# EAGLE schematic fig4-9 (EAGLE 6.6.0)

## Sheet 1 of 2
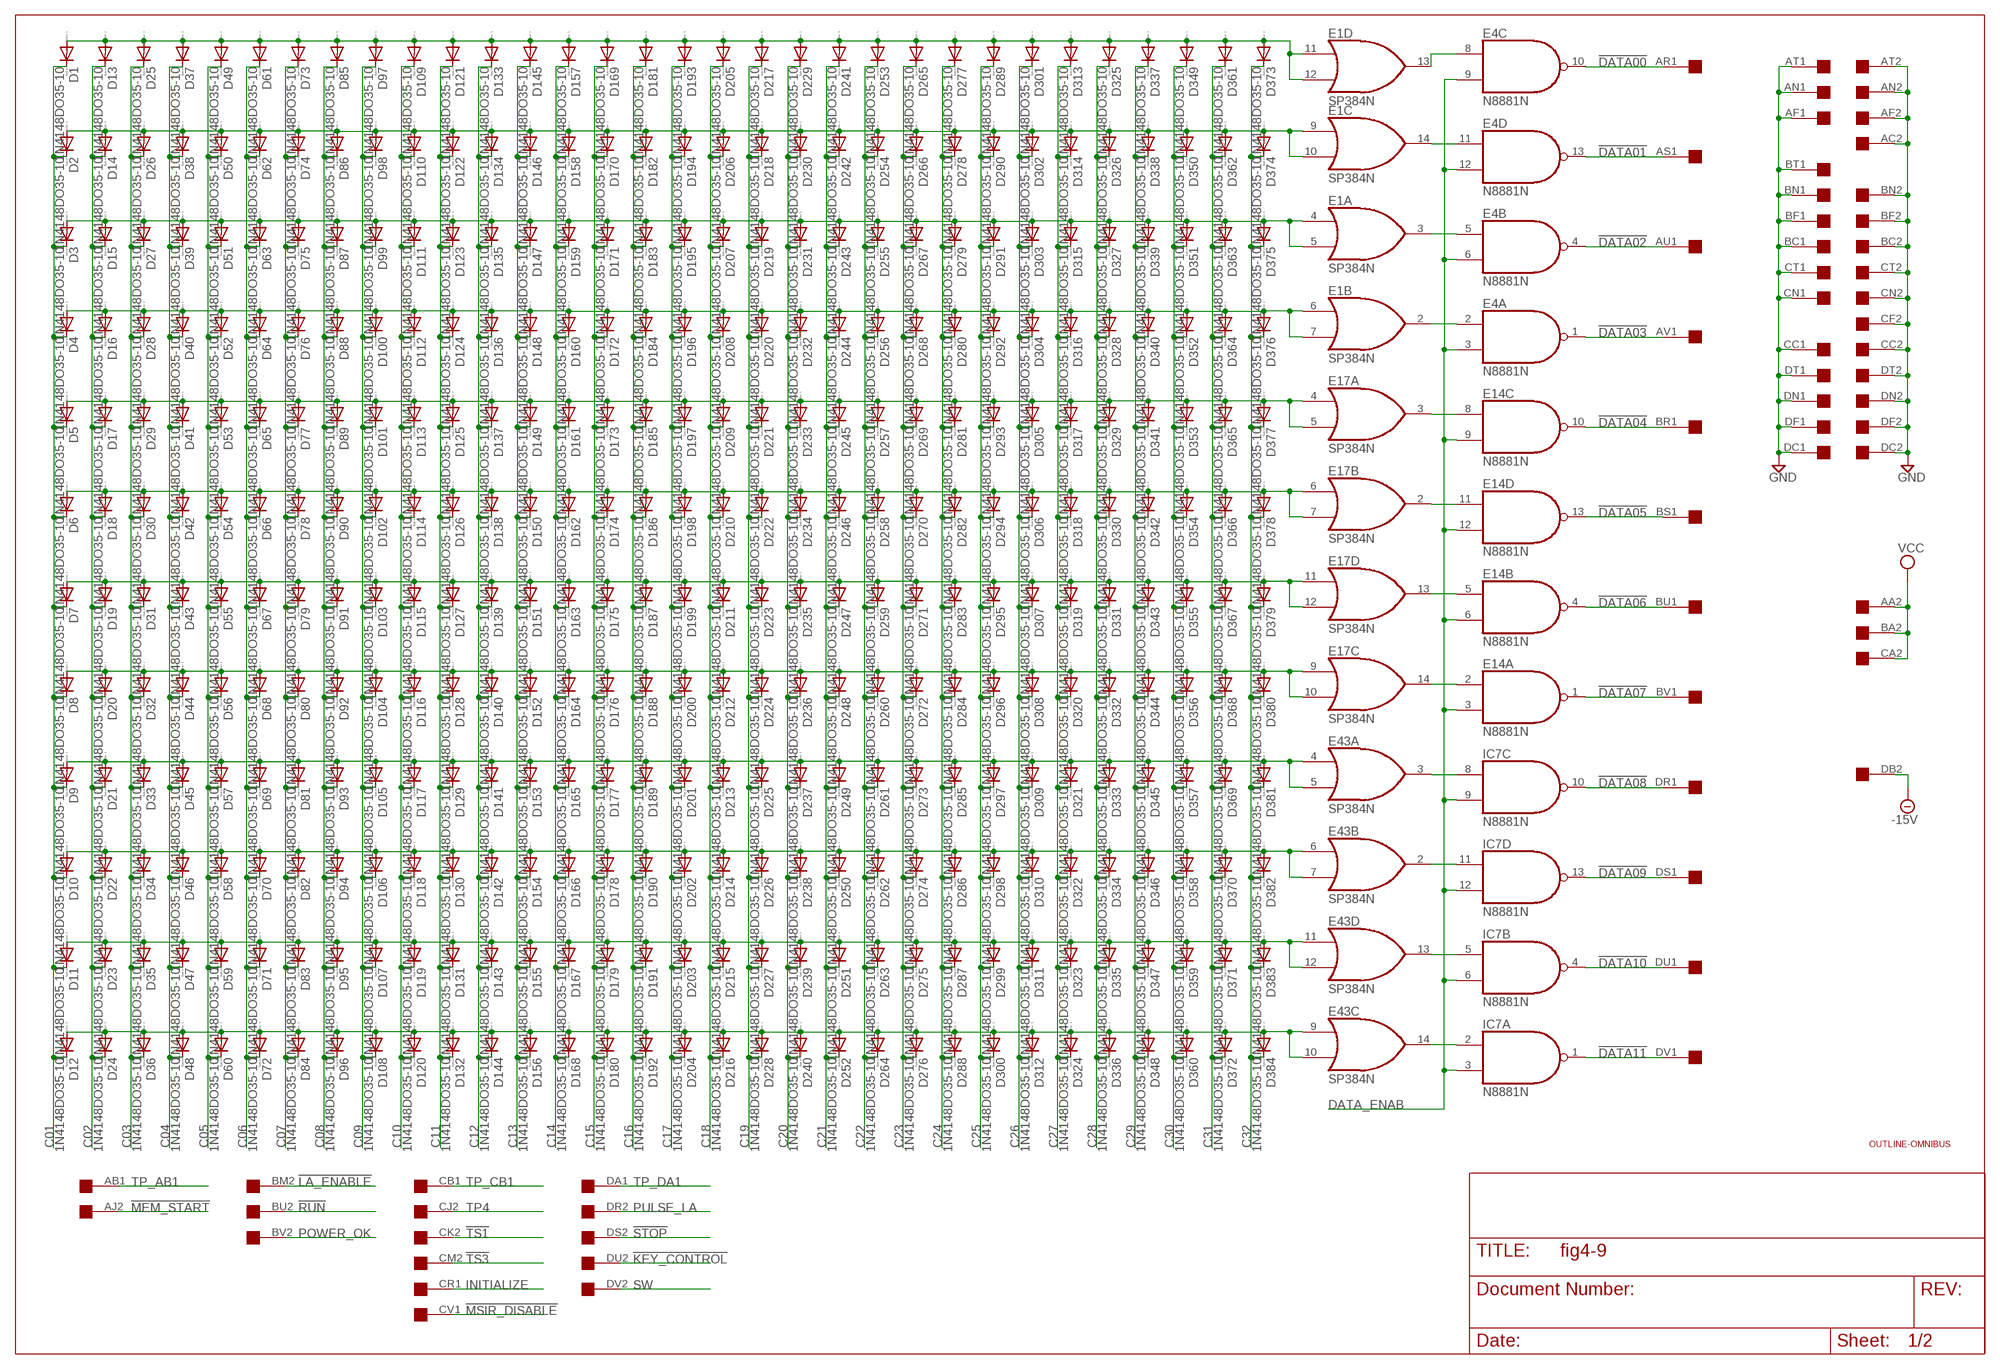
[diagram p0: schematic, sheet 1]

### Parts
D1  1N4148DO35-10  [DO35-10]
D2  1N4148DO35-10  [DO35-10]
D3  1N4148DO35-10  [DO35-10]
D4  1N4148DO35-10  [DO35-10]
D5  1N4148DO35-10  [DO35-10]
D6  1N4148DO35-10  [DO35-10]
D7  1N4148DO35-10  [DO35-10]
D8  1N4148DO35-10  [DO35-10]
D9  1N4148DO35-10  [DO35-10]
D10  1N4148DO35-10  [DO35-10]
D11  1N4148DO35-10  [DO35-10]
D12  1N4148DO35-10  [DO35-10]
D13  1N4148DO35-10  [DO35-10]
D14  1N4148DO35-10  [DO35-10]
D15  1N4148DO35-10  [DO35-10]
D16  1N4148DO35-10  [DO35-10]
D17  1N4148DO35-10  [DO35-10]
D18  1N4148DO35-10  [DO35-10]
D19  1N4148DO35-10  [DO35-10]
D20  1N4148DO35-10  [DO35-10]
D21  1N4148DO35-10  [DO35-10]
D22  1N4148DO35-10  [DO35-10]
D23  1N4148DO35-10  [DO35-10]
D24  1N4148DO35-10  [DO35-10]
D25  1N4148DO35-10  [DO35-10]
D26  1N4148DO35-10  [DO35-10]
D27  1N4148DO35-10  [DO35-10]
D28  1N4148DO35-10  [DO35-10]
D29  1N4148DO35-10  [DO35-10]
D30  1N4148DO35-10  [DO35-10]
D31  1N4148DO35-10  [DO35-10]
D32  1N4148DO35-10  [DO35-10]
D33  1N4148DO35-10  [DO35-10]
D34  1N4148DO35-10  [DO35-10]
D35  1N4148DO35-10  [DO35-10]
D36  1N4148DO35-10  [DO35-10]
D37  1N4148DO35-10  [DO35-10]
D38  1N4148DO35-10  [DO35-10]
D39  1N4148DO35-10  [DO35-10]
D40  1N4148DO35-10  [DO35-10]
D41  1N4148DO35-10  [DO35-10]
D42  1N4148DO35-10  [DO35-10]
D43  1N4148DO35-10  [DO35-10]
D44  1N4148DO35-10  [DO35-10]
D45  1N4148DO35-10  [DO35-10]
D46  1N4148DO35-10  [DO35-10]
D47  1N4148DO35-10  [DO35-10]
D48  1N4148DO35-10  [DO35-10]
D49  1N4148DO35-10  [DO35-10]
D50  1N4148DO35-10  [DO35-10]
D51  1N4148DO35-10  [DO35-10]
D52  1N4148DO35-10  [DO35-10]
D53  1N4148DO35-10  [DO35-10]
D54  1N4148DO35-10  [DO35-10]
D55  1N4148DO35-10  [DO35-10]
D56  1N4148DO35-10  [DO35-10]
D57  1N4148DO35-10  [DO35-10]
D58  1N4148DO35-10  [DO35-10]
D59  1N4148DO35-10  [DO35-10]
D60  1N4148DO35-10  [DO35-10]
D61  1N4148DO35-10  [DO35-10]
D62  1N4148DO35-10  [DO35-10]
D63  1N4148DO35-10  [DO35-10]
D64  1N4148DO35-10  [DO35-10]
D65  1N4148DO35-10  [DO35-10]
D66  1N4148DO35-10  [DO35-10]
D67  1N4148DO35-10  [DO35-10]
D68  1N4148DO35-10  [DO35-10]
D69  1N4148DO35-10  [DO35-10]
D70  1N4148DO35-10  [DO35-10]
D71  1N4148DO35-10  [DO35-10]
D72  1N4148DO35-10  [DO35-10]
D73  1N4148DO35-10  [DO35-10]
D74  1N4148DO35-10  [DO35-10]
D75  1N4148DO35-10  [DO35-10]
D76  1N4148DO35-10  [DO35-10]
D77  1N4148DO35-10  [DO35-10]
D78  1N4148DO35-10  [DO35-10]
D79  1N4148DO35-10  [DO35-10]
D80  1N4148DO35-10  [DO35-10]
D81  1N4148DO35-10  [DO35-10]
D82  1N4148DO35-10  [DO35-10]
D83  1N4148DO35-10  [DO35-10]
D84  1N4148DO35-10  [DO35-10]
D85  1N4148DO35-10  [DO35-10]
D86  1N4148DO35-10  [DO35-10]
D87  1N4148DO35-10  [DO35-10]
D88  1N4148DO35-10  [DO35-10]
D89  1N4148DO35-10  [DO35-10]
D90  1N4148DO35-10  [DO35-10]
D91  1N4148DO35-10  [DO35-10]
D92  1N4148DO35-10  [DO35-10]
D93  1N4148DO35-10  [DO35-10]
D94  1N4148DO35-10  [DO35-10]
D95  1N4148DO35-10  [DO35-10]
D96  1N4148DO35-10  [DO35-10]
D97  1N4148DO35-10  [DO35-10]
D98  1N4148DO35-10  [DO35-10]
D99  1N4148DO35-10  [DO35-10]
D100  1N4148DO35-10  [DO35-10]
D101  1N4148DO35-10  [DO35-10]
D102  1N4148DO35-10  [DO35-10]
D103  1N4148DO35-10  [DO35-10]
D104  1N4148DO35-10  [DO35-10]
D105  1N4148DO35-10  [DO35-10]
D106  1N4148DO35-10  [DO35-10]
D107  1N4148DO35-10  [DO35-10]
D108  1N4148DO35-10  [DO35-10]
D109  1N4148DO35-10  [DO35-10]
D110  1N4148DO35-10  [DO35-10]
D111  1N4148DO35-10  [DO35-10]
D112  1N4148DO35-10  [DO35-10]
D113  1N4148DO35-10  [DO35-10]
D114  1N4148DO35-10  [DO35-10]
D115  1N4148DO35-10  [DO35-10]
D116  1N4148DO35-10  [DO35-10]
D117  1N4148DO35-10  [DO35-10]
D118  1N4148DO35-10  [DO35-10]
D119  1N4148DO35-10  [DO35-10]
D120  1N4148DO35-10  [DO35-10]
D121  1N4148DO35-10  [DO35-10]
D122  1N4148DO35-10  [DO35-10]
D123  1N4148DO35-10  [DO35-10]
D124  1N4148DO35-10  [DO35-10]
D125  1N4148DO35-10  [DO35-10]
D126  1N4148DO35-10  [DO35-10]
D127  1N4148DO35-10  [DO35-10]
D128  1N4148DO35-10  [DO35-10]
D129  1N4148DO35-10  [DO35-10]
D130  1N4148DO35-10  [DO35-10]
D131  1N4148DO35-10  [DO35-10]
D132  1N4148DO35-10  [DO35-10]
D133  1N4148DO35-10  [DO35-10]
D134  1N4148DO35-10  [DO35-10]
D135  1N4148DO35-10  [DO35-10]
D136  1N4148DO35-10  [DO35-10]
D137  1N4148DO35-10  [DO35-10]
D138  1N4148DO35-10  [DO35-10]
D139  1N4148DO35-10  [DO35-10]
D140  1N4148DO35-10  [DO35-10]
D141  1N4148DO35-10  [DO35-10]
D142  1N4148DO35-10  [DO35-10]
D143  1N4148DO35-10  [DO35-10]
D144  1N4148DO35-10  [DO35-10]
D145  1N4148DO35-10  [DO35-10]
D146  1N4148DO35-10  [DO35-10]
D147  1N4148DO35-10  [DO35-10]
D148  1N4148DO35-10  [DO35-10]
D149  1N4148DO35-10  [DO35-10]
D150  1N4148DO35-10  [DO35-10]
D151  1N4148DO35-10  [DO35-10]
D152  1N4148DO35-10  [DO35-10]
D153  1N4148DO35-10  [DO35-10]
D154  1N4148DO35-10  [DO35-10]
D155  1N4148DO35-10  [DO35-10]
D156  1N4148DO35-10  [DO35-10]
D157  1N4148DO35-10  [DO35-10]
D158  1N4148DO35-10  [DO35-10]
D159  1N4148DO35-10  [DO35-10]
D160  1N4148DO35-10  [DO35-10]
D161  1N4148DO35-10  [DO35-10]
D162  1N4148DO35-10  [DO35-10]
D163  1N4148DO35-10  [DO35-10]
D164  1N4148DO35-10  [DO35-10]
D165  1N4148DO35-10  [DO35-10]
D166  1N4148DO35-10  [DO35-10]
D167  1N4148DO35-10  [DO35-10]
D168  1N4148DO35-10  [DO35-10]
D169  1N4148DO35-10  [DO35-10]
D170  1N4148DO35-10  [DO35-10]
D171  1N4148DO35-10  [DO35-10]
D172  1N4148DO35-10  [DO35-10]
D173  1N4148DO35-10  [DO35-10]
D174  1N4148DO35-10  [DO35-10]
D175  1N4148DO35-10  [DO35-10]
D176  1N4148DO35-10  [DO35-10]
D177  1N4148DO35-10  [DO35-10]
D178  1N4148DO35-10  [DO35-10]
D179  1N4148DO35-10  [DO35-10]
D180  1N4148DO35-10  [DO35-10]
D181  1N4148DO35-10  [DO35-10]
D182  1N4148DO35-10  [DO35-10]
D183  1N4148DO35-10  [DO35-10]
D184  1N4148DO35-10  [DO35-10]
D185  1N4148DO35-10  [DO35-10]
D186  1N4148DO35-10  [DO35-10]
D187  1N4148DO35-10  [DO35-10]
D188  1N4148DO35-10  [DO35-10]
D189  1N4148DO35-10  [DO35-10]
D190  1N4148DO35-10  [DO35-10]
D191  1N4148DO35-10  [DO35-10]
D192  1N4148DO35-10  [DO35-10]
D193  1N4148DO35-10  [DO35-10]
D194  1N4148DO35-10  [DO35-10]
D195  1N4148DO35-10  [DO35-10]
D196  1N4148DO35-10  [DO35-10]
D197  1N4148DO35-10  [DO35-10]
D198  1N4148DO35-10  [DO35-10]
D199  1N4148DO35-10  [DO35-10]
D200  1N4148DO35-10  [DO35-10]
D201  1N4148DO35-10  [DO35-10]
D202  1N4148DO35-10  [DO35-10]
D203  1N4148DO35-10  [DO35-10]
D204  1N4148DO35-10  [DO35-10]
D205  1N4148DO35-10  [DO35-10]
D206  1N4148DO35-10  [DO35-10]
D207  1N4148DO35-10  [DO35-10]
D208  1N4148DO35-10  [DO35-10]
D209  1N4148DO35-10  [DO35-10]
D210  1N4148DO35-10  [DO35-10]
D211  1N4148DO35-10  [DO35-10]
D212  1N4148DO35-10  [DO35-10]
D213  1N4148DO35-10  [DO35-10]
D214  1N4148DO35-10  [DO35-10]
D215  1N4148DO35-10  [DO35-10]
D216  1N4148DO35-10  [DO35-10]
D217  1N4148DO35-10  [DO35-10]
D218  1N4148DO35-10  [DO35-10]
D219  1N4148DO35-10  [DO35-10]
D220  1N4148DO35-10  [DO35-10]
D221  1N4148DO35-10  [DO35-10]
D222  1N4148DO35-10  [DO35-10]
D223  1N4148DO35-10  [DO35-10]
D224  1N4148DO35-10  [DO35-10]
D225  1N4148DO35-10  [DO35-10]
D226  1N4148DO35-10  [DO35-10]
D227  1N4148DO35-10  [DO35-10]
D228  1N4148DO35-10  [DO35-10]
D229  1N4148DO35-10  [DO35-10]
D230  1N4148DO35-10  [DO35-10]
D231  1N4148DO35-10  [DO35-10]
D232  1N4148DO35-10  [DO35-10]
D233  1N4148DO35-10  [DO35-10]
D234  1N4148DO35-10  [DO35-10]
D235  1N4148DO35-10  [DO35-10]
D236  1N4148DO35-10  [DO35-10]
D237  1N4148DO35-10  [DO35-10]
D238  1N4148DO35-10  [DO35-10]
D239  1N4148DO35-10  [DO35-10]
D240  1N4148DO35-10  [DO35-10]
D241  1N4148DO35-10  [DO35-10]
D242  1N4148DO35-10  [DO35-10]
D243  1N4148DO35-10  [DO35-10]
D244  1N4148DO35-10  [DO35-10]
D245  1N4148DO35-10  [DO35-10]
D246  1N4148DO35-10  [DO35-10]
D247  1N4148DO35-10  [DO35-10]
D248  1N4148DO35-10  [DO35-10]
D249  1N4148DO35-10  [DO35-10]
D250  1N4148DO35-10  [DO35-10]
D251  1N4148DO35-10  [DO35-10]
D252  1N4148DO35-10  [DO35-10]
D253  1N4148DO35-10  [DO35-10]
D254  1N4148DO35-10  [DO35-10]
D255  1N4148DO35-10  [DO35-10]
D256  1N4148DO35-10  [DO35-10]
D257  1N4148DO35-10  [DO35-10]
D258  1N4148DO35-10  [DO35-10]
D259  1N4148DO35-10  [DO35-10]
D260  1N4148DO35-10  [DO35-10]
D261  1N4148DO35-10  [DO35-10]
D262  1N4148DO35-10  [DO35-10]
D263  1N4148DO35-10  [DO35-10]
D264  1N4148DO35-10  [DO35-10]
D265  1N4148DO35-10  [DO35-10]
D266  1N4148DO35-10  [DO35-10]
D267  1N4148DO35-10  [DO35-10]
D268  1N4148DO35-10  [DO35-10]
D269  1N4148DO35-10  [DO35-10]
D270  1N4148DO35-10  [DO35-10]
D271  1N4148DO35-10  [DO35-10]
D272  1N4148DO35-10  [DO35-10]
D273  1N4148DO35-10  [DO35-10]
D274  1N4148DO35-10  [DO35-10]
D275  1N4148DO35-10  [DO35-10]
D276  1N4148DO35-10  [DO35-10]
D277  1N4148DO35-10  [DO35-10]
D278  1N4148DO35-10  [DO35-10]
D279  1N4148DO35-10  [DO35-10]
D280  1N4148DO35-10  [DO35-10]
D281  1N4148DO35-10  [DO35-10]
D282  1N4148DO35-10  [DO35-10]
D283  1N4148DO35-10  [DO35-10]
D284  1N4148DO35-10  [DO35-10]
D285  1N4148DO35-10  [DO35-10]
D286  1N4148DO35-10  [DO35-10]
D287  1N4148DO35-10  [DO35-10]
D288  1N4148DO35-10  [DO35-10]
D289  1N4148DO35-10  [DO35-10]
D290  1N4148DO35-10  [DO35-10]
D291  1N4148DO35-10  [DO35-10]
D292  1N4148DO35-10  [DO35-10]
D293  1N4148DO35-10  [DO35-10]
D294  1N4148DO35-10  [DO35-10]
D295  1N4148DO35-10  [DO35-10]
D296  1N4148DO35-10  [DO35-10]
D297  1N4148DO35-10  [DO35-10]
D298  1N4148DO35-10  [DO35-10]
D299  1N4148DO35-10  [DO35-10]
D300  1N4148DO35-10  [DO35-10]
D301  1N4148DO35-10  [DO35-10]
D302  1N4148DO35-10  [DO35-10]
D303  1N4148DO35-10  [DO35-10]
D304  1N4148DO35-10  [DO35-10]
D305  1N4148DO35-10  [DO35-10]
D306  1N4148DO35-10  [DO35-10]
D307  1N4148DO35-10  [DO35-10]
D308  1N4148DO35-10  [DO35-10]
D309  1N4148DO35-10  [DO35-10]
D310  1N4148DO35-10  [DO35-10]
D311  1N4148DO35-10  [DO35-10]
D312  1N4148DO35-10  [DO35-10]
D313  1N4148DO35-10  [DO35-10]
D314  1N4148DO35-10  [DO35-10]
D315  1N4148DO35-10  [DO35-10]
D316  1N4148DO35-10  [DO35-10]
D317  1N4148DO35-10  [DO35-10]
D318  1N4148DO35-10  [DO35-10]
D319  1N4148DO35-10  [DO35-10]
D320  1N4148DO35-10  [DO35-10]
D321  1N4148DO35-10  [DO35-10]
D322  1N4148DO35-10  [DO35-10]
D323  1N4148DO35-10  [DO35-10]
D324  1N4148DO35-10  [DO35-10]
D325  1N4148DO35-10  [DO35-10]
D326  1N4148DO35-10  [DO35-10]
D327  1N4148DO35-10  [DO35-10]
D328  1N4148DO35-10  [DO35-10]
D329  1N4148DO35-10  [DO35-10]
D330  1N4148DO35-10  [DO35-10]
D331  1N4148DO35-10  [DO35-10]
D332  1N4148DO35-10  [DO35-10]
D333  1N4148DO35-10  [DO35-10]
D334  1N4148DO35-10  [DO35-10]
D335  1N4148DO35-10  [DO35-10]
D336  1N4148DO35-10  [DO35-10]
D337  1N4148DO35-10  [DO35-10]
D338  1N4148DO35-10  [DO35-10]
D339  1N4148DO35-10  [DO35-10]
D340  1N4148DO35-10  [DO35-10]
D341  1N4148DO35-10  [DO35-10]
D342  1N4148DO35-10  [DO35-10]
D343  1N4148DO35-10  [DO35-10]
D344  1N4148DO35-10  [DO35-10]
D345  1N4148DO35-10  [DO35-10]
D346  1N4148DO35-10  [DO35-10]
D347  1N4148DO35-10  [DO35-10]
D348  1N4148DO35-10  [DO35-10]
D349  1N4148DO35-10  [DO35-10]
D350  1N4148DO35-10  [DO35-10]
D351  1N4148DO35-10  [DO35-10]
D352  1N4148DO35-10  [DO35-10]
D353  1N4148DO35-10  [DO35-10]
D354  1N4148DO35-10  [DO35-10]
D355  1N4148DO35-10  [DO35-10]
D356  1N4148DO35-10  [DO35-10]
D357  1N4148DO35-10  [DO35-10]
D358  1N4148DO35-10  [DO35-10]
D359  1N4148DO35-10  [DO35-10]
D360  1N4148DO35-10  [DO35-10]
D361  1N4148DO35-10  [DO35-10]
D362  1N4148DO35-10  [DO35-10]
D363  1N4148DO35-10  [DO35-10]
D364  1N4148DO35-10  [DO35-10]
D365  1N4148DO35-10  [DO35-10]
D366  1N4148DO35-10  [DO35-10]
D367  1N4148DO35-10  [DO35-10]
D368  1N4148DO35-10  [DO35-10]
D369  1N4148DO35-10  [DO35-10]
D370  1N4148DO35-10  [DO35-10]
D371  1N4148DO35-10  [DO35-10]
D372  1N4148DO35-10  [DO35-10]
D373  1N4148DO35-10  [DO35-10]
D374  1N4148DO35-10  [DO35-10]
D375  1N4148DO35-10  [DO35-10]
D376  1N4148DO35-10  [DO35-10]
D377  1N4148DO35-10  [DO35-10]
D378  1N4148DO35-10  [DO35-10]
D379  1N4148DO35-10  [DO35-10]
D380  1N4148DO35-10  [DO35-10]
D381  1N4148DO35-10  [DO35-10]
D382  1N4148DO35-10  [DO35-10]
D383  1N4148DO35-10  [DO35-10]
D384  1N4148DO35-10  [DO35-10]
E1  SP384N  [DIL14]
E4  N8881N  [DIL14]
E14  N8881N  [DIL14]
E17  SP384N  [DIL14]
E43  SP384N  [DIL14]
IC7  N8881N  [DIL14]
U$1  OUTLINE-OMNIBUS  [OMNIBUS]
U$2  QUAD  [EDGE-CON8]

### Nets
!DATA00: E4.10(C:O) U$2.AR1
!DATA01: E4.13(D:O) U$2.AS1
!DATA02: E4.4(B:O) U$2.AU1
!DATA03: E4.1(A:O) U$2.AV1
!DATA04: E14.10(C:O) U$2.BR1
!DATA05: E14.13(D:O) U$2.BS1
!DATA06: E14.4(B:O) U$2.BU1
!DATA07: E14.1(A:O) U$2.BV1
!DATA08: IC7.10(C:O) U$2.DR1
!DATA09: IC7.13(D:O) U$2.DS1
!DATA10: IC7.4(B:O) U$2.DU1
!DATA11: IC7.1(A:O) U$2.DV1
!KEY_CONTROL: U$2.DU2
!LA_ENABLE: U$2.BM2
!MEM_START: U$2.AJ2
!MSIR_DISABLE: U$2.CV1
!RUN: U$2.BU2
!STOP: U$2.DS2
!TS1: U$2.CK2 ; also sheet 2
!TS3: U$2.CM2
-15V: U$2.DB2
C01: D1.C D2.C D3.C D4.C D5.C D6.C D7.C D8.C D9.C D10.C D11.C D12.C ; also sheet 2
C02: D13.C D14.C D15.C D16.C D17.C D18.C D19.C D20.C D21.C D22.C D23.C D24.C ; also sheet 2
C03: D25.C D26.C D27.C D28.C D29.C D30.C D31.C D32.C D33.C D34.C D35.C D36.C ; also sheet 2
C04: D37.C D38.C D39.C D40.C D41.C D42.C D43.C D44.C D45.C D46.C D47.C D48.C ; also sheet 2
C05: D49.C D50.C D51.C D52.C D53.C D54.C D55.C D56.C D57.C D58.C D59.C D60.C ; also sheet 2
C06: D61.C D62.C D63.C D64.C D65.C D66.C D67.C D68.C D69.C D70.C D71.C D72.C ; also sheet 2
C07: D73.C D74.C D75.C D76.C D77.C D78.C D79.C D80.C D81.C D82.C D83.C D84.C ; also sheet 2
C08: D85.C D86.C D87.C D88.C D89.C D90.C D91.C D92.C D93.C D94.C D95.C D96.C ; also sheet 2
C09: D97.C D98.C D99.C D100.C D101.C D102.C D103.C D104.C D105.C D106.C D107.C D108.C ; also sheet 2
C10: D109.C D110.C D111.C D112.C D113.C D114.C D115.C D116.C D117.C D118.C D119.C D120.C ; also sheet 2
C11: D121.C D122.C D123.C D124.C D125.C D126.C D127.C D128.C D129.C D130.C D131.C D132.C ; also sheet 2
C12: D133.C D134.C D135.C D136.C D137.C D138.C D139.C D140.C D141.C D142.C D143.C D144.C ; also sheet 2
C13: D145.C D146.C D147.C D148.C D149.C D150.C D151.C D152.C D153.C D154.C D155.C D156.C ; also sheet 2
C14: D157.C D158.C D159.C D160.C D161.C D162.C D163.C D164.C D165.C D166.C D167.C D168.C ; also sheet 2
C15: D169.C D170.C D171.C D172.C D173.C D174.C D175.C D176.C D177.C D178.C D179.C D180.C ; also sheet 2
C16: D181.C D182.C D183.C D184.C D185.C D186.C D187.C D188.C D189.C D190.C D191.C D192.C ; also sheet 2
C17: D193.C D194.C D195.C D196.C D197.C D198.C D199.C D200.C D201.C D202.C D203.C D204.C ; also sheet 2
C18: D205.C D206.C D207.C D208.C D209.C D210.C D211.C D212.C D213.C D214.C D215.C D216.C ; also sheet 2
C19: D217.C D218.C D219.C D220.C D221.C D222.C D223.C D224.C D225.C D226.C D227.C D228.C ; also sheet 2
C20: D229.C D230.C D231.C D232.C D233.C D234.C D235.C D236.C D237.C D238.C D239.C D240.C ; also sheet 2
C21: D241.C D242.C D243.C D244.C D245.C D246.C D247.C D248.C D249.C D250.C D251.C D252.C ; also sheet 2
C22: D253.C D254.C D255.C D256.C D257.C D258.C D259.C D260.C D261.C D262.C D263.C D264.C ; also sheet 2
C23: D265.C D266.C D267.C D268.C D269.C D270.C D271.C D272.C D273.C D274.C D275.C D276.C ; also sheet 2
C24: D277.C D278.C D279.C D280.C D281.C D282.C D283.C D284.C D285.C D286.C D287.C D288.C ; also sheet 2
C25: D289.C D290.C D291.C D292.C D293.C D294.C D295.C D296.C D297.C D298.C D299.C D300.C ; also sheet 2
C26: D301.C D302.C D303.C D304.C D305.C D306.C D307.C D308.C D309.C D310.C D311.C D312.C ; also sheet 2
C27: D313.C D314.C D315.C D316.C D317.C D318.C D319.C D320.C D321.C D322.C D323.C D324.C ; also sheet 2
C28: D325.C D326.C D327.C D328.C D329.C D330.C D331.C D332.C D333.C D334.C D335.C D336.C ; also sheet 2
C29: D337.C D338.C D339.C D340.C D341.C D342.C D343.C D344.C D345.C D346.C D347.C D348.C ; also sheet 2
C30: D349.C D350.C D351.C D352.C D353.C D354.C D355.C D356.C D357.C D358.C D359.C D360.C ; also sheet 2
C31: D361.C D362.C D363.C D364.C D365.C D366.C D367.C D368.C D369.C D370.C D371.C D372.C ; also sheet 2
C32: D373.C D374.C D375.C D376.C D377.C D378.C D379.C D380.C D381.C D382.C D383.C D384.C ; also sheet 2
DATA_ENAB: E4.3(A:I1) E4.6(B:I1) E4.9(C:I1) E4.12(D:I1) E14.3(A:I1) E14.6(B:I1) E14.9(C:I1) E14.12(D:I1) IC7.3(A:I1) IC7.6(B:I1) IC7.9(C:I1) IC7.12(D:I1)
GND: U$2.AC2 U$2.AF1 U$2.AF2 U$2.AN1 U$2.AN2 U$2.AT1 U$2.AT2 U$2.BC1 U$2.BC2 U$2.BF1 U$2.BF2 U$2.BN1 U$2.BN2 U$2.BT1 U$2.CC1 U$2.CC2 U$2.CF2 U$2.CN1 U$2.CN2 U$2.CT1 U$2.CT2 U$2.DC1 U$2.DC2 U$2.DF1 U$2.DF2 U$2.DN1 U$2.DN2 U$2.DT1 U$2.DT2 ; also sheet 2
INITIALIZE: U$2.CR1
N$33: D1.A D13.A D25.A D37.A D49.A D61.A D73.A D85.A D97.A D109.A D121.A D133.A D145.A D157.A D169.A D181.A D193.A D205.A D217.A D229.A D241.A D253.A D265.A D277.A D289.A D301.A D313.A D325.A D337.A D349.A D361.A D373.A E1.11(D:I0) E1.12(D:I1)
N$34: D12.A D24.A D36.A D48.A D60.A D72.A D84.A D96.A D108.A D120.A D132.A D144.A D156.A D168.A D180.A D192.A D204.A D216.A D228.A D240.A D252.A D264.A D276.A D288.A D300.A D312.A D324.A D336.A D348.A D360.A D372.A D384.A E43.9(C:I0) E43.10(C:I1)
N$35: D11.A D23.A D35.A D47.A D59.A D71.A D83.A D95.A D107.A D119.A D131.A D143.A D155.A D167.A D179.A D191.A D203.A D215.A D227.A D239.A D251.A D263.A D275.A D287.A D299.A D311.A D323.A D335.A D347.A D359.A D371.A D383.A E43.11(D:I0) E43.12(D:I1)
N$36: D10.A D22.A D34.A D46.A D58.A D70.A D82.A D94.A D106.A D118.A D130.A D142.A D154.A D166.A D178.A D190.A D202.A D214.A D226.A D238.A D250.A D262.A D274.A D286.A D298.A D310.A D322.A D334.A D346.A D358.A D370.A D382.A E43.6(B:I0) E43.7(B:I1)
N$37: D8.A D20.A D32.A D44.A D56.A D68.A D80.A D92.A D104.A D116.A D128.A D140.A D152.A D164.A D176.A D188.A D200.A D212.A D224.A D236.A D248.A D260.A D272.A D284.A D296.A D308.A D320.A D332.A D344.A D356.A D368.A D380.A E17.9(C:I0) E17.10(C:I1)
N$38: D7.A D19.A D31.A D43.A D55.A D67.A D79.A D91.A D103.A D115.A D127.A D139.A D151.A D163.A D175.A D187.A D199.A D211.A D223.A D235.A D247.A D259.A D271.A D283.A D295.A D307.A D319.A D331.A D343.A D355.A D367.A D379.A E17.11(D:I0) E17.12(D:I1)
N$39: D9.A D21.A D33.A D45.A D57.A D69.A D81.A D93.A D105.A D117.A D129.A D141.A D153.A D165.A D177.A D189.A D201.A D213.A D225.A D237.A D249.A D261.A D273.A D285.A D297.A D309.A D321.A D333.A D345.A D357.A D369.A D381.A E43.4(A:I0) E43.5(A:I1)
N$40: D6.A D18.A D30.A D42.A D54.A D66.A D78.A D90.A D102.A D114.A D126.A D138.A D150.A D162.A D174.A D186.A D198.A D210.A D222.A D234.A D246.A D258.A D270.A D282.A D294.A D306.A D318.A D330.A D342.A D354.A D366.A D378.A E17.6(B:I0) E17.7(B:I1)
N$41: D5.A D17.A D29.A D41.A D53.A D65.A D77.A D89.A D101.A D113.A D125.A D137.A D149.A D161.A D173.A D185.A D197.A D209.A D221.A D233.A D245.A D257.A D269.A D281.A D293.A D305.A D317.A D329.A D341.A D353.A D365.A D377.A E17.4(A:I0) E17.5(A:I1)
N$42: D4.A D16.A D28.A D40.A D52.A D64.A D76.A D88.A D100.A D112.A D124.A D136.A D148.A D160.A D172.A D184.A D196.A D208.A D220.A D232.A D244.A D256.A D268.A D280.A D292.A D304.A D316.A D328.A D340.A D352.A D364.A D376.A E1.6(B:I0) E1.7(B:I1)
N$43: D3.A D15.A D27.A D39.A D51.A D63.A D75.A D87.A D99.A D111.A D123.A D135.A D147.A D159.A D171.A D183.A D195.A D207.A D219.A D231.A D243.A D255.A D267.A D279.A D291.A D303.A D315.A D327.A D339.A D351.A D363.A D375.A E1.4(A:I0) E1.5(A:I1)
N$44: D2.A D14.A D26.A D38.A D50.A D62.A D74.A D86.A D98.A D110.A D122.A D134.A D146.A D158.A D170.A D182.A D194.A D206.A D218.A D230.A D242.A D254.A D266.A D278.A D290.A D302.A D314.A D326.A D338.A D350.A D362.A D374.A E1.9(C:I0) E1.10(C:I1)
N$45: E14.5(B:I0) E17.13(D:O)
N$46: E14.11(D:I0) E17.2(B:O)
N$47: E14.8(C:I0) E17.3(A:O)
N$48: E1.2(B:O) E4.2(A:I0)
N$49: E1.3(A:O) E4.5(B:I0)
N$50: E1.14(C:O) E4.11(D:I0)
N$51: E1.13(D:O) E4.8(C:I0)
N$52: E43.14(C:O) IC7.2(A:I0)
N$53: E43.13(D:O) IC7.5(B:I0)
N$54: E43.2(B:O) IC7.11(D:I0)
N$55: E43.3(A:O) IC7.8(C:I0)
N$56: E14.2(A:I0) E17.14(C:O)
POWER_OK: U$2.BV2
PULSE_LA: U$2.DR2
SW: U$2.DV2
TP4: U$2.CJ2
TP_AB1: U$2.AB1
TP_CB1: U$2.CB1
TP_DA1: U$2.DA1
VCC: U$2.AA2 U$2.BA2 U$2.CA2
Unconnected: U$2.AA1 U$2.AB2 U$2.AC1 U$2.AD1 U$2.AD2 U$2.AE1 U$2.AE2 U$2.AH1 U$2.AH2 U$2.AJ1 U$2.AK1 U$2.AK2 U$2.AL1 U$2.AL2 U$2.AM1 U$2.AM2 U$2.AP1 U$2.AP2 U$2.AR2 U$2.AS2 U$2.AU2 U$2.AV2 U$2.BA1 U$2.BB1 U$2.BB2 U$2.BD1 U$2.BD2 U$2.BE1 U$2.BE2 U$2.BH1 U$2.BH2 U$2.BJ1 U$2.BJ2 U$2.BK1 U$2.BK2 U$2.BL1 U$2.BL2 U$2.BM1 U$2.BP1 U$2.BP2 U$2.BR2 U$2.BS2 U$2.BT2 U$2.CA1 U$2.CB2 U$2.CD1 U$2.CD2 U$2.CE1 U$2.CE2 U$2.CF1 U$2.CH1 U$2.CH2 U$2.CJ1 U$2.CK1 U$2.CL1 U$2.CL2 U$2.CM1 U$2.CP1 U$2.CP2 U$2.CR2 U$2.CS1 U$2.CS2 U$2.CU1 U$2.CU2 U$2.CV2 U$2.DA2 U$2.DB1 U$2.DD1 U$2.DD2 U$2.DE1 U$2.DE2 U$2.DH1 U$2.DH2 U$2.DJ1 U$2.DJ2 U$2.DK1 U$2.DK2 U$2.DL1 U$2.DL2 U$2.DM1 U$2.DM2 U$2.DP1 U$2.DP2

## Sheet 2 of 2
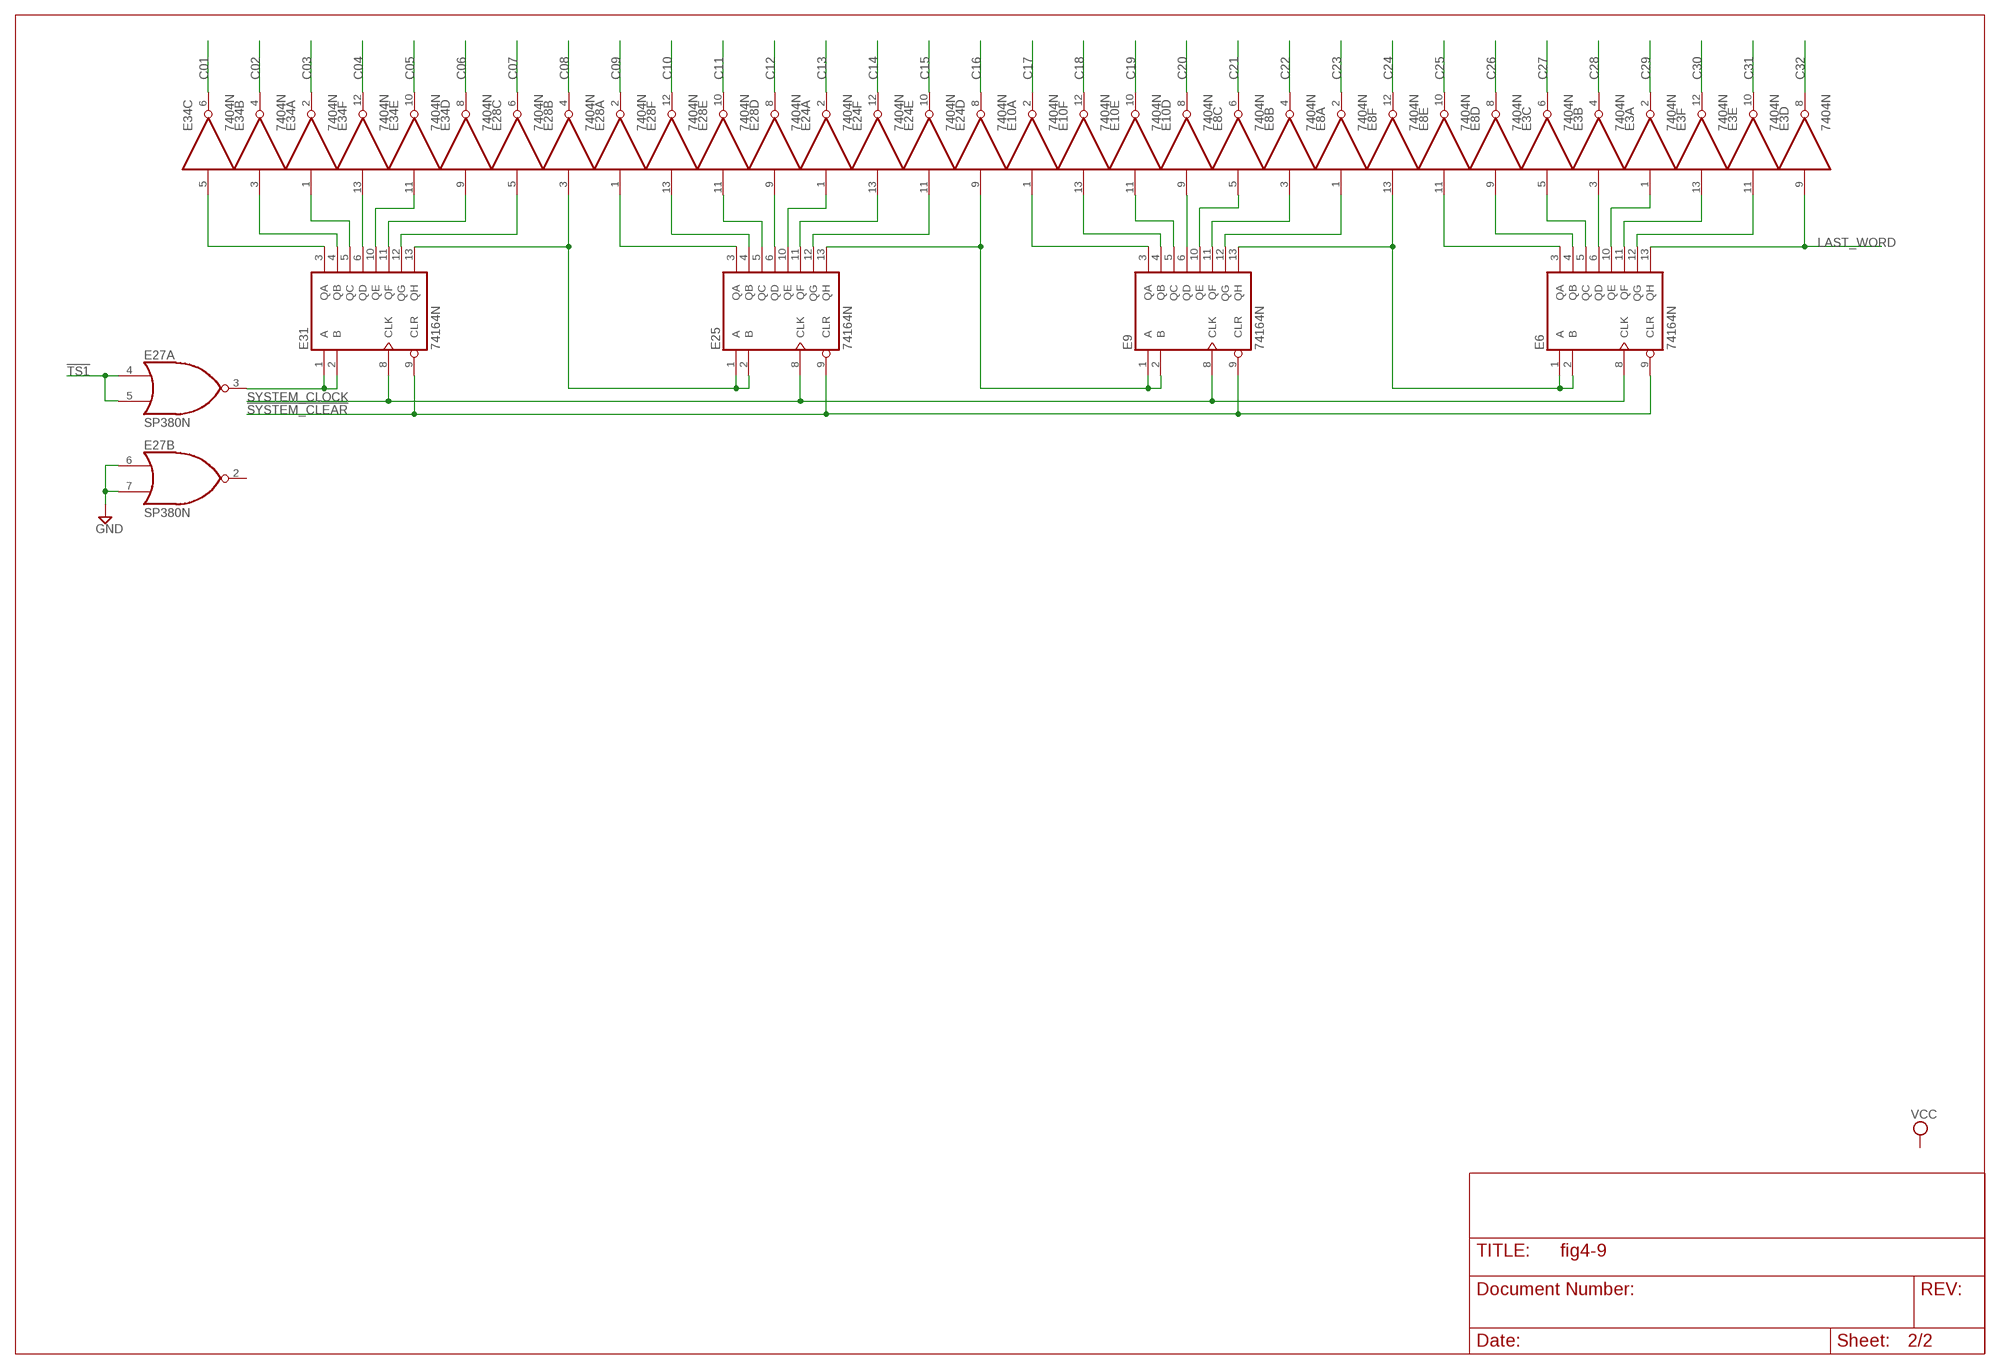
[diagram p1: schematic, sheet 2]

### Parts
E3  7404N  [DIL14]
E6  74164N  [DIL14]
E8  7404N  [DIL14]
E9  74164N  [DIL14]
E10  7404N  [DIL14]
E24  7404N  [DIL14]
E25  74164N  [DIL14]
E27  SP380N  [DIL14]
E28  7404N  [DIL14]
E31  74164N  [DIL14]
E34  7404N  [DIL14]

### Nets
!SYSTEM_CLEAR: E6.9(CLR) E9.9(CLR) E25.9(CLR) E31.9(CLR)
!TS1: E27.4(A:I0) E27.5(A:I1) ; also sheet 1
C01: E34.6(C:O) ; also sheet 1
C02: E34.4(B:O) ; also sheet 1
C03: E34.2(A:O) ; also sheet 1
C04: E34.12(F:O) ; also sheet 1
C05: E34.10(E:O) ; also sheet 1
C06: E34.8(D:O) ; also sheet 1
C07: E28.6(C:O) ; also sheet 1
C08: E28.4(B:O) ; also sheet 1
C09: E28.2(A:O) ; also sheet 1
C10: E28.12(F:O) ; also sheet 1
C11: E28.10(E:O) ; also sheet 1
C12: E28.8(D:O) ; also sheet 1
C13: E24.2(A:O) ; also sheet 1
C14: E24.12(F:O) ; also sheet 1
C15: E24.10(E:O) ; also sheet 1
C16: E24.8(D:O) ; also sheet 1
C17: E10.2(A:O) ; also sheet 1
C18: E10.12(F:O) ; also sheet 1
C19: E10.10(E:O) ; also sheet 1
C20: E10.8(D:O) ; also sheet 1
C21: E8.6(C:O) ; also sheet 1
C22: E8.4(B:O) ; also sheet 1
C23: E8.2(A:O) ; also sheet 1
C24: E8.12(F:O) ; also sheet 1
C25: E8.10(E:O) ; also sheet 1
C26: E8.8(D:O) ; also sheet 1
C27: E3.6(C:O) ; also sheet 1
C28: E3.4(B:O) ; also sheet 1
C29: E3.2(A:O) ; also sheet 1
C30: E3.12(F:O) ; also sheet 1
C31: E3.10(E:O) ; also sheet 1
C32: E3.8(D:O) ; also sheet 1
GND: E27.6(B:I0) E27.7(B:I1) ; also sheet 1
LAST_WORD: E3.9(D:I) E6.13(QH)
N$1: E27.3(A:O) E31.1(A) E31.2(B)
N$32: E31.3(QA) E34.5(C:I)
N$69: E31.6(QD) E34.13(F:I)
N$70: E9.5(QC) E10.11(E:I)
N$71: E9.6(QD) E10.9(D:I)
N$72: E3.3(B:I) E6.6(QD)
N$73: E31.4(QB) E34.3(B:I)
N$74: E31.5(QC) E34.1(A:I)
N$75: E31.10(QE) E34.11(E:I)
N$76: E31.11(QF) E34.9(D:I)
N$77: E28.5(C:I) E31.12(QG)
N$78: E25.3(QA) E28.1(A:I)
N$79: E25.4(QB) E28.13(F:I)
N$80: E25.5(QC) E28.11(E:I)
N$81: E25.6(QD) E28.9(D:I)
N$82: E24.1(A:I) E25.10(QE)
N$83: E9.3(QA) E10.1(A:I)
N$84: E6.3(QA) E8.11(E:I)
N$85: E3.11(E:I) E6.12(QG)
N$86: E3.13(F:I) E6.11(QF)
N$87: E3.1(A:I) E6.10(QE)
N$88: E24.13(F:I) E25.11(QF)
N$89: E24.11(E:I) E25.12(QG)
N$90: E9.4(QB) E10.13(F:I)
N$91: E8.5(C:I) E9.10(QE)
N$92: E8.3(B:I) E9.11(QF)
N$93: E8.1(A:I) E9.12(QG)
N$94: E6.4(QB) E8.9(D:I)
N$95: E3.5(C:I) E6.5(QC)
N$96: E6.1(A) E6.2(B) E8.13(F:I) E9.13(QH)
N$97: E9.1(A) E9.2(B) E24.9(D:I) E25.13(QH)
N$98: E25.1(A) E25.2(B) E28.3(B:I) E31.13(QH)
SYSTEM_CLOCK: E6.8(CLK) E9.8(CLK) E25.8(CLK) E31.8(CLK)
Unconnected: E10.3(B:I) E10.4(B:O) E10.5(C:I) E10.6(C:O) E24.3(B:I) E24.4(B:O) E24.5(C:I) E24.6(C:O) E27.2(B:O) E27.9(C:I0) E27.10(C:I1) E27.11(D:I0) E27.12(D:I1) E27.13(D:O) E27.14(C:O)

## Power pins joined to a net without a drawn wire
GND: E1.1(GND) E3.7(P:GND) E4.7(P:GND) E6.7(GND) E8.7(P:GND) E9.7(GND) E10.7(P:GND) E14.7(P:GND) E17.1(GND) E24.7(P:GND) E25.7(GND) E27.1(P:GND) E28.7(P:GND) E31.7(GND) E34.7(P:GND) E43.1(GND) IC7.7(P:GND)
VCC: E1.8(VCC) E3.14(P:VCC) E4.14(P:VCC) E6.14(VCC) E8.14(P:VCC) E9.14(VCC) E10.14(P:VCC) E14.14(P:VCC) E17.8(VCC) E24.14(P:VCC) E25.14(VCC) E27.8(P:VCC) E28.14(P:VCC) E31.14(VCC) E34.14(P:VCC) E43.8(VCC) IC7.14(P:VCC)

## Library data of the parts
D1-D384 = diode:1N4148: DIODE high speed (Philips)
E1 E17 E43 = dec-con:SP384: Quad OR gate
E3 E8 E10 E24 E28 E34 = 74xx-us:74*04: Hex INVERTER
E4 E14 IC7 = dec-con:N8881: Quad 2-input NAND gate, open collector
E6 E9 E25 E31 = 74xx-us:74*164: 8-bit parallel out SHIFT REGISTER
E27 = dec-con:SP380: Quad NOR gate (use 8640)
U$1 = dec-con:OUTLINE-*: Board outlines for DEC boards.
U$2 = dec-con:QUAD: Quad-Height DEC board